# Altium project EEM_FMC_Carrier.PrjPCB (part 9 of 9)
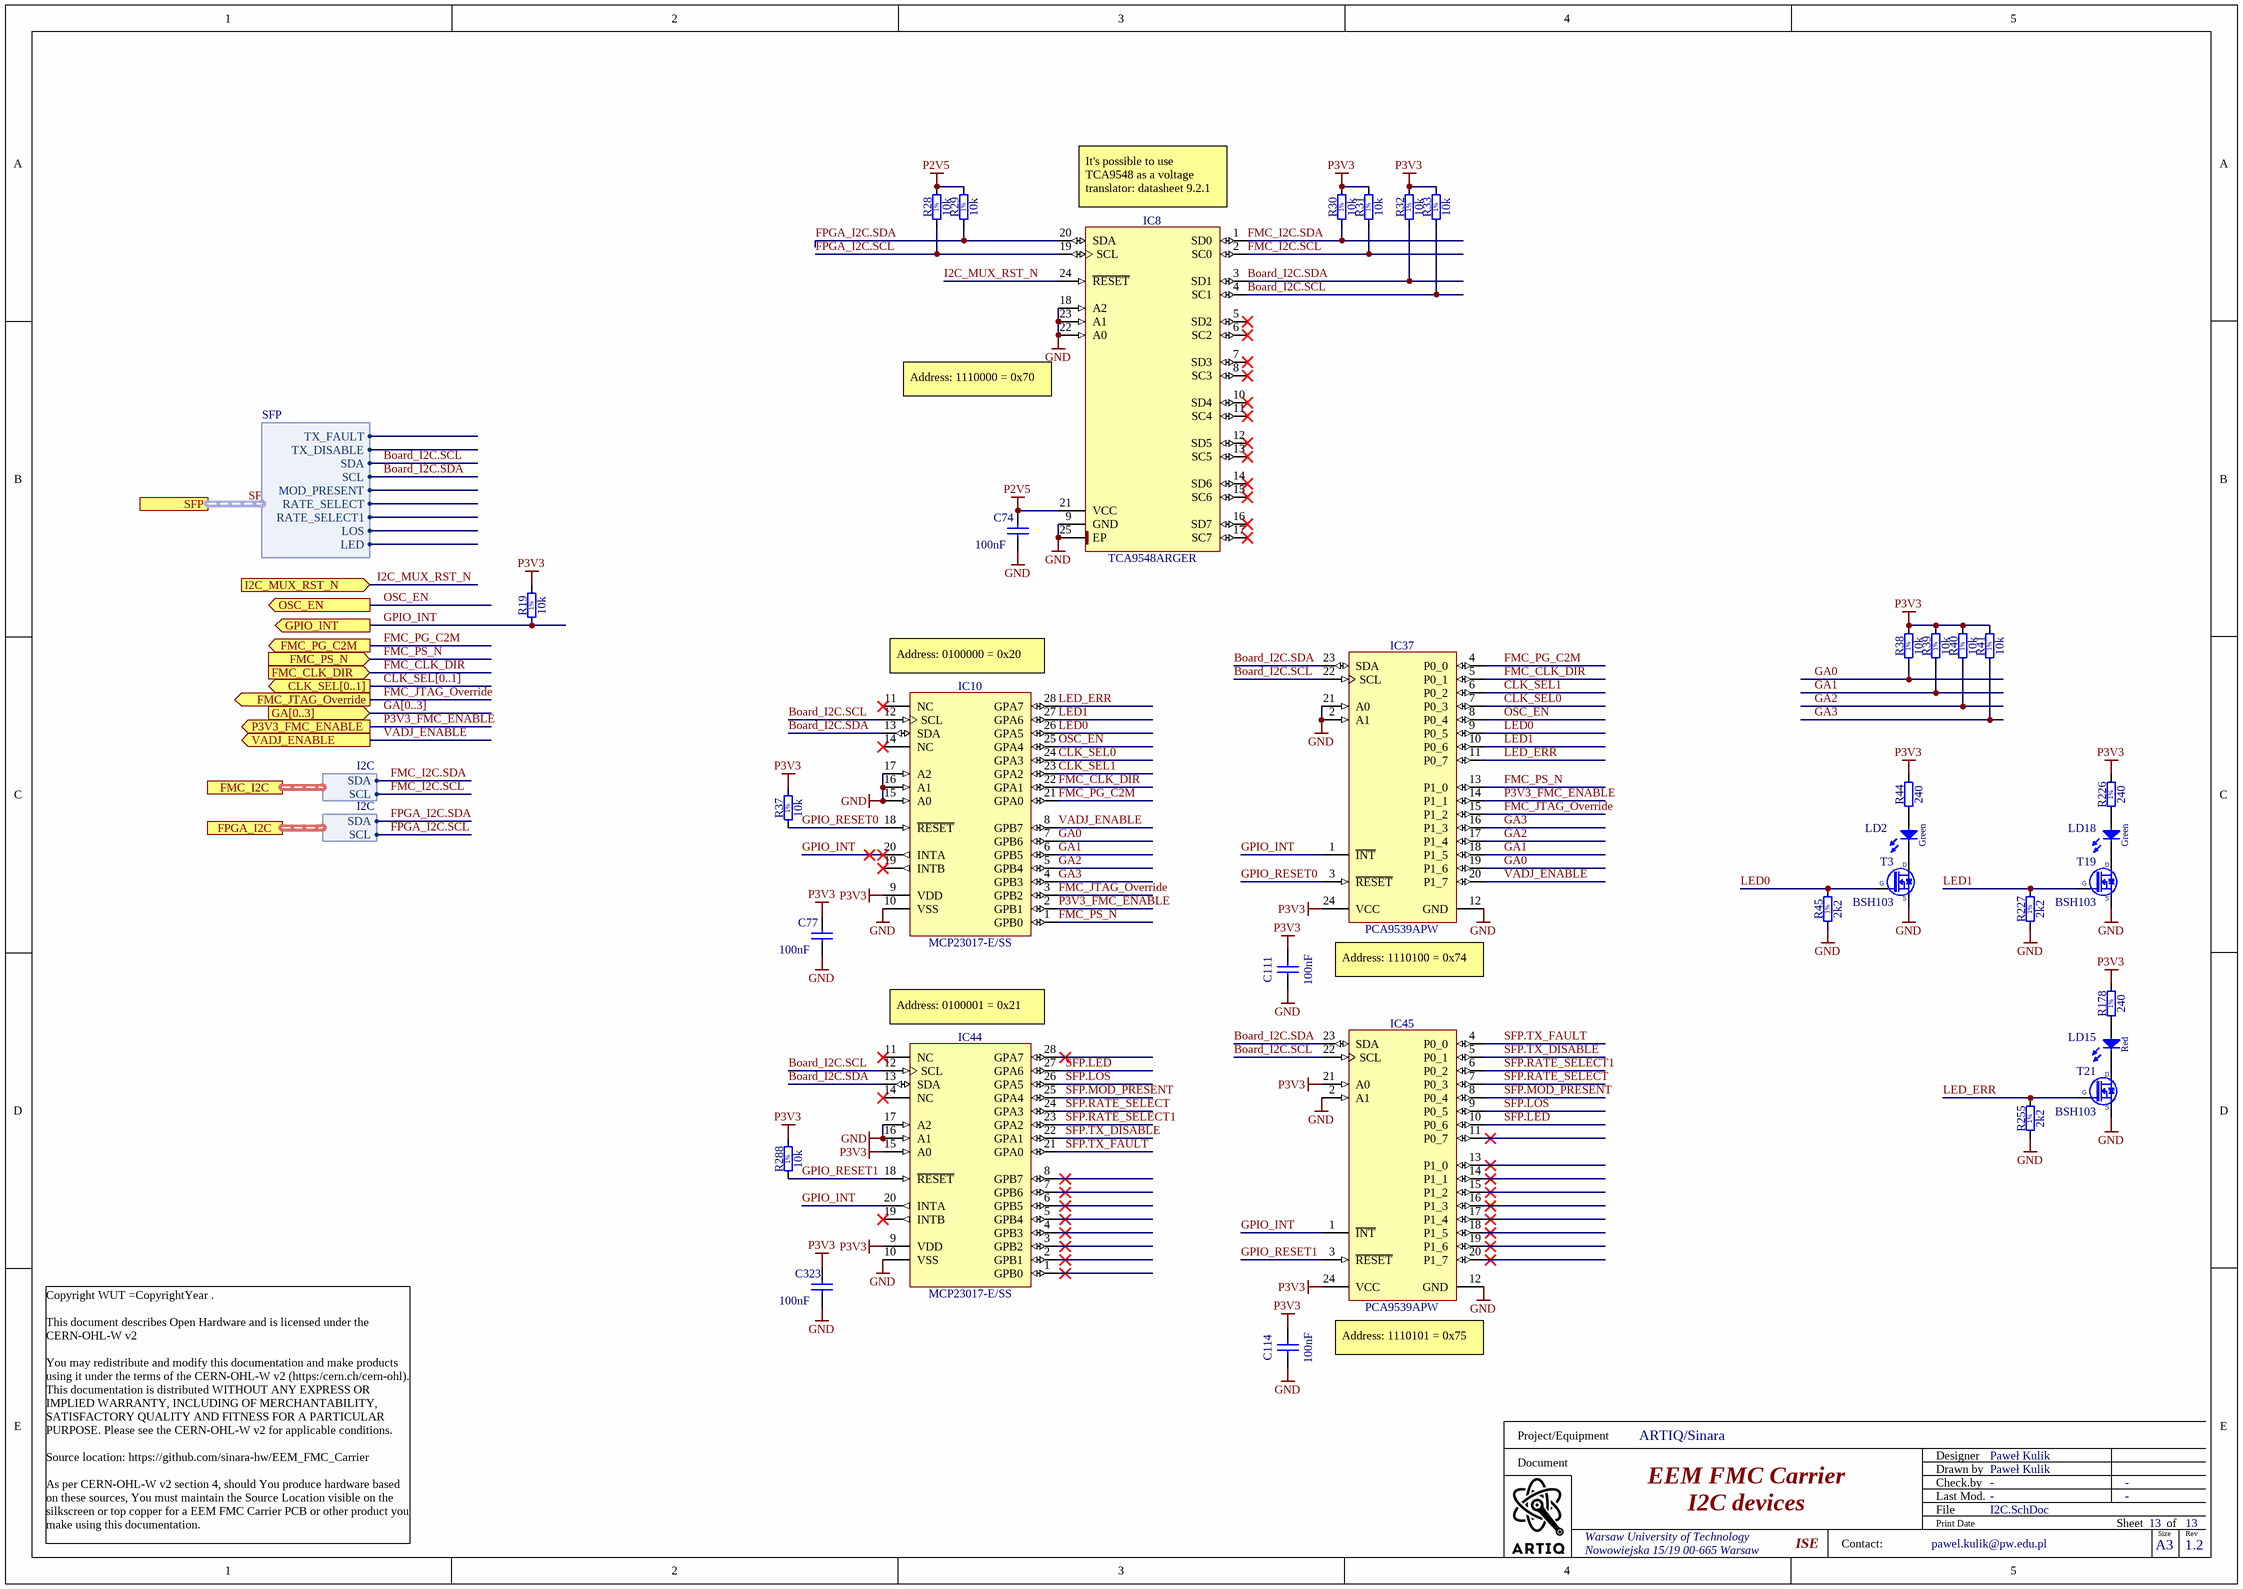
[diagram p15: I2C.SchDoc]

## Nets that join several sheets
FMC_VREFA_M2C: FPGA_FMC (C41.2 C45.2 IC4.C20 IC4.D15), FMC_Connector (J5.h1)
FMC_VREFB_M2C: FPGA_FMC (C64#1.2 C65#1.2 IC4.V3 IC4.W7), FMC_Connector (J5.k1)
GND: EEM_FMC_Carrier (C212.2 R119.2 R126.2), FPGA_EEM_Misc (28 pins), Power_Supplies (111 pins), CLK_Distribution (38 pins), FPGA_FMC (20 pins), FPGA_Bank_0_Supplies (182 pins), FPGA_GTP (60 pins), FPGA_SDRAM (60 pins), JTAG_Flash_Update (51 pins), FMC_Connector (186 pins), CPCIS_Connectors_P1_P6 (62 pins), EEM_Connectors_JTAG (65 pins), I2C (28 pins)
MGTAVCC: Power_Supplies (C242.2 L18.2), FPGA_Bank_0_Supplies (8 pins)
MGTAVTT: Power_Supplies (L23.2), FPGA_Bank_0_Supplies (9 pins), FPGA_GTP (R26.1)
P1V0: Power_Supplies (7 pins), FPGA_Bank_0_Supplies (41 pins)
P1V5: Power_Supplies (L22.2 T12.1 TP6.1), FPGA_Bank_0_Supplies (13 pins), FPGA_SDRAM (33 pins)
P1V8: Power_Supplies (5 pins), FPGA_Bank_0_Supplies (C173.2 L3.1 L5.1)
P2V5: FPGA_EEM_Misc (8 pins), Power_Supplies (8 pins), FPGA_Bank_0_Supplies (22 pins), JTAG_Flash_Update (19 pins), I2C (C74.2 IC8.21 R28.2 R29.2)
P3V3: FPGA_EEM_Misc (7 pins), Power_Supplies (7 pins), CLK_Distribution (11 pins), FPGA_FMC (6 pins), FPGA_Bank_0_Supplies (R76.2), FPGA_GTP (19 pins), FPGA_SDRAM (C88.2 IC12.7 IC12.10 R70.2), JTAG_Flash_Update (18 pins), FMC_Connector (5 pins), EEM_Connectors_JTAG (19 pins), I2C (24 pins)
P3V3_FMC: Power_Supplies (5 pins), FMC_Connector (7 pins)
P3V3_MP: Power_Supplies (5 pins), JTAG_Flash_Update (R101.2), EEM_Connectors_JTAG (5 pins)
P3V3_MP_B: Power_Supplies (C43.1 D11.2 IC14.5), CPCIS_Connectors_P1_P6 (8 pins)
P12V0: FPGA_EEM_Misc (C72.2 R27.2 T1.2), Power_Supplies (16 pins), FPGA_SDRAM (L29.1), FMC_Connector (C204.1 C205.1 J5.c35 J5.c37), CPCIS_Connectors_P1_P6 (7 pins), EEM_Connectors_JTAG (J8.28 J8.29 J9.28 J9.29)
VADJ_FMC: Power_Supplies (9 pins), FPGA_FMC (7 pins), FPGA_Bank_0_Supplies (48 pins), FMC_Connector (21 pins)
VCCBRAM: Power_Supplies (C243.2 L16.2), FPGA_Bank_0_Supplies (7 pins)
Board_I2C.SCL: FPGA_GTP (J3.4), I2C (6 pins)
Board_I2C.SDA: FPGA_GTP (J3.5), I2C (6 pins)
BP_I2C.SCL: CPCIS_Connectors_P1_P6 (D5.3 J6.B2), EEM_Connectors_JTAG (R77.1)
BP_I2C.SDA: CPCIS_Connectors_P1_P6 (D5.1 J6.C2), EEM_Connectors_JTAG (R3.1)
BP_IO.LVDS_N0: CPCIS_Connectors_P1_P6 (J6.E3), EEM_Connectors_JTAG (R161.1)
BP_IO.LVDS_N1: CPCIS_Connectors_P1_P6 (J6.B3), EEM_Connectors_JTAG (R162.1)
BP_IO.LVDS_N2: CPCIS_Connectors_P1_P6 (J6.C4), EEM_Connectors_JTAG (R163.1)
BP_IO.LVDS_N3: CPCIS_Connectors_P1_P6 (J6.L4), EEM_Connectors_JTAG (R164.1)
BP_IO.LVDS_N4: CPCIS_Connectors_P1_P6 (J6.I4), EEM_Connectors_JTAG (R167.1)
BP_IO.LVDS_N5: CPCIS_Connectors_P1_P6 (J6.K5), EEM_Connectors_JTAG (R168.1)
BP_IO.LVDS_N6: CPCIS_Connectors_P1_P6 (J6.H5), EEM_Connectors_JTAG (R169.1)
BP_IO.LVDS_N7: CPCIS_Connectors_P1_P6 (J6.F6), EEM_Connectors_JTAG (R170.1)
BP_IO.LVDS_N8: CPCIS_Connectors_P1_P6 (J6.C6), EEM_Connectors_JTAG (R171.1)
BP_IO.LVDS_N9: CPCIS_Connectors_P1_P6 (J6.L6), EEM_Connectors_JTAG (R172.1)
BP_IO.LVDS_N10: CPCIS_Connectors_P1_P6 (J6.I6), EEM_Connectors_JTAG (R173.1)
BP_IO.LVDS_N11: CPCIS_Connectors_P1_P6 (J7.E1), EEM_Connectors_JTAG (R174.1)
BP_IO.LVDS_N12: CPCIS_Connectors_P1_P6 (J7.B1), EEM_Connectors_JTAG (R175.1)
BP_IO.LVDS_N13: CPCIS_Connectors_P1_P6 (J7.K1), EEM_Connectors_JTAG (R176.1)
BP_IO.LVDS_N14: CPCIS_Connectors_P1_P6 (J7.H1), EEM_Connectors_JTAG (R177.1)
BP_IO.LVDS_N15: CPCIS_Connectors_P1_P6 (J6.F2), EEM_Connectors_JTAG (R144.2)
BP_IO.LVDS_P0: CPCIS_Connectors_P1_P6 (J6.D3), EEM_Connectors_JTAG (R145.1)
BP_IO.LVDS_P1: CPCIS_Connectors_P1_P6 (J6.A3), EEM_Connectors_JTAG (R146.1)
BP_IO.LVDS_P2: CPCIS_Connectors_P1_P6 (J6.B4), EEM_Connectors_JTAG (R147.1)
BP_IO.LVDS_P3: CPCIS_Connectors_P1_P6 (J6.K4), EEM_Connectors_JTAG (R148.1)
BP_IO.LVDS_P4: CPCIS_Connectors_P1_P6 (J6.H4), EEM_Connectors_JTAG (R149.1)
BP_IO.LVDS_P5: CPCIS_Connectors_P1_P6 (J6.J5), EEM_Connectors_JTAG (R150.1)
BP_IO.LVDS_P6: CPCIS_Connectors_P1_P6 (J6.G5), EEM_Connectors_JTAG (R151.1)
BP_IO.LVDS_P7: CPCIS_Connectors_P1_P6 (J6.E6), EEM_Connectors_JTAG (R152.1)
BP_IO.LVDS_P8: CPCIS_Connectors_P1_P6 (J6.B6), EEM_Connectors_JTAG (R153.1)
BP_IO.LVDS_P9: CPCIS_Connectors_P1_P6 (J6.K6), EEM_Connectors_JTAG (R154.1)
BP_IO.LVDS_P10: CPCIS_Connectors_P1_P6 (J6.H6), EEM_Connectors_JTAG (R155.1)
BP_IO.LVDS_P11: CPCIS_Connectors_P1_P6 (J7.D1), EEM_Connectors_JTAG (R156.1)
BP_IO.LVDS_P12: CPCIS_Connectors_P1_P6 (J7.A1), EEM_Connectors_JTAG (R157.1)
BP_IO.LVDS_P13: CPCIS_Connectors_P1_P6 (J7.J1), EEM_Connectors_JTAG (R158.1)
BP_IO.LVDS_P14: CPCIS_Connectors_P1_P6 (J7.G1), EEM_Connectors_JTAG (R159.1)
BP_IO.LVDS_P15: CPCIS_Connectors_P1_P6 (J6.E2), EEM_Connectors_JTAG (R143.2)
BP_JTAG.TCK: JTAG_Flash_Update (IC16.3), EEM_Connectors_JTAG (IC30.10)
BP_JTAG.TDI: JTAG_Flash_Update (IC16.13), EEM_Connectors_JTAG (IC30.15)
BP_JTAG.TDO: JTAG_Flash_Update (IC16.10), EEM_Connectors_JTAG (IC31.2)
BP_JTAG.TMS: JTAG_Flash_Update (IC16.6), EEM_Connectors_JTAG (IC30.11)
BP_JTAG.TRSTn: JTAG_Flash_Update (IC19.1), EEM_Connectors_JTAG (IC30.14)
BP_MGT.Rx_N: FPGA_GTP (IC36.14), CPCIS_Connectors_P1_P6 (R142.1)
BP_MGT.Rx_P: FPGA_GTP (IC36.15), CPCIS_Connectors_P1_P6 (R141.1)
BP_MGT.Tx_N: FPGA_GTP (IC36.12), CPCIS_Connectors_P1_P6 (R246.1)
BP_MGT.Tx_P: FPGA_GTP (IC36.13), CPCIS_Connectors_P1_P6 (R245.1)
CFG_CCLK: FPGA_Bank_0_Supplies (IC4.L12), JTAG_Flash_Update (IC20.9 IC22.16)
CFG_D02: FPGA_EEM_Misc (IC4.P21), JTAG_Flash_Update (IC22.9 R98.1)
CFG_D03: FPGA_EEM_Misc (IC4.R21), JTAG_Flash_Update (IC22.1 R99.1)
CFG_DIN_D1: FPGA_EEM_Misc (IC4.R22), JTAG_Flash_Update (IC20.3 IC22.8)
CFG_FCS: FPGA_EEM_Misc (IC4.T19), JTAG_Flash_Update (IC20.10 IC22.7 R100.1)
CFG_MOSI_D0: FPGA_EEM_Misc (IC4.P22), JTAG_Flash_Update (IC20.2 IC22.15)
CLK_SEL0: CLK_Distribution (IC2.15 SW1.1 T18.1), I2C (IC10.24 IC37.7)
CLK_SEL1: CLK_Distribution (IC2.18 SW1.2), I2C (IC10.23 IC37.6)
EEM0_I2C.SCL: Power_Supplies (IC33.2), JTAG_Flash_Update (IC23.6), EEM_Connectors_JTAG (5 pins)
EEM0_I2C.SDA: Power_Supplies (IC33.1), JTAG_Flash_Update (IC23.5), EEM_Connectors_JTAG (5 pins)
EEM_IO.LVDS_N0: FPGA_EEM_Misc (IC4.V19), EEM_Connectors_JTAG (IC27.18)
EEM_IO.LVDS_N1: FPGA_EEM_Misc (IC4.R17), EEM_Connectors_JTAG (IC27.16)
EEM_IO.LVDS_N2: FPGA_EEM_Misc (IC4.T18), EEM_Connectors_JTAG (IC28.18)
EEM_IO.LVDS_N3: FPGA_EEM_Misc (IC4.W17), EEM_Connectors_JTAG (IC28.16)
EEM_IO.LVDS_N4: FPGA_EEM_Misc (IC4.R19), EEM_Connectors_JTAG (IC29.18)
EEM_IO.LVDS_N5: FPGA_EEM_Misc (IC4.R16), EEM_Connectors_JTAG (J8.18 R168.2)
EEM_IO.LVDS_N6: FPGA_EEM_Misc (IC4.U18), EEM_Connectors_JTAG (J8.21 R169.2)
EEM_IO.LVDS_N7: FPGA_EEM_Misc (IC4.AA21), EEM_Connectors_JTAG (J8.24 R170.2)
EEM_IO.LVDS_N8: FPGA_EEM_Misc (IC4.V20), EEM_Connectors_JTAG (J9.3 R171.2)
EEM_IO.LVDS_N9: FPGA_EEM_Misc (IC4.P17), EEM_Connectors_JTAG (J9.6 R172.2)
EEM_IO.LVDS_N10: FPGA_EEM_Misc (IC4.N14), EEM_Connectors_JTAG (J9.9 R173.2)
EEM_IO.LVDS_N11: FPGA_EEM_Misc (IC4.Y22), EEM_Connectors_JTAG (J9.12 R174.2)
EEM_IO.LVDS_N12: FPGA_EEM_Misc (IC4.W22), EEM_Connectors_JTAG (J9.15 R175.2)
EEM_IO.LVDS_N13: FPGA_EEM_Misc (IC4.AB22), EEM_Connectors_JTAG (J9.18 R176.2)
EEM_IO.LVDS_N14: FPGA_EEM_Misc (IC4.AB20), EEM_Connectors_JTAG (J9.21 R177.2)
EEM_IO.LVDS_N15: FPGA_EEM_Misc (IC4.AB18), EEM_Connectors_JTAG (J9.24 R144.1)
EEM_IO.LVDS_P0: FPGA_EEM_Misc (IC4.V18), EEM_Connectors_JTAG (IC27.19)
EEM_IO.LVDS_P1: FPGA_EEM_Misc (IC4.P16), EEM_Connectors_JTAG (IC27.17)
EEM_IO.LVDS_P2: FPGA_EEM_Misc (IC4.R18), EEM_Connectors_JTAG (IC28.19)
EEM_IO.LVDS_P3: FPGA_EEM_Misc (IC4.V17), EEM_Connectors_JTAG (IC28.17)
EEM_IO.LVDS_P4: FPGA_EEM_Misc (IC4.P19), EEM_Connectors_JTAG (IC29.19)
EEM_IO.LVDS_P5: FPGA_EEM_Misc (IC4.P15), EEM_Connectors_JTAG (J8.17 R150.2)
EEM_IO.LVDS_P6: FPGA_EEM_Misc (IC4.U17), EEM_Connectors_JTAG (J8.20 R151.2)
EEM_IO.LVDS_P7: FPGA_EEM_Misc (IC4.AA20), EEM_Connectors_JTAG (J8.23 R152.2)
EEM_IO.LVDS_P8: FPGA_EEM_Misc (IC4.U20), EEM_Connectors_JTAG (J9.2 R153.2)
EEM_IO.LVDS_P9: FPGA_EEM_Misc (IC4.N17), EEM_Connectors_JTAG (J9.5 R154.2)
EEM_IO.LVDS_P10: FPGA_EEM_Misc (IC4.N13), EEM_Connectors_JTAG (J9.8 R155.2)
EEM_IO.LVDS_P11: FPGA_EEM_Misc (IC4.Y21), EEM_Connectors_JTAG (J9.11 R156.2)
EEM_IO.LVDS_P12: FPGA_EEM_Misc (IC4.W21), EEM_Connectors_JTAG (J9.14 R157.2)
EEM_IO.LVDS_P13: FPGA_EEM_Misc (IC4.AB21), EEM_Connectors_JTAG (J9.17 R158.2)
EEM_IO.LVDS_P14: FPGA_EEM_Misc (IC4.AA19), EEM_Connectors_JTAG (J9.20 R159.2)
EEM_IO.LVDS_P15: FPGA_EEM_Misc (IC4.AA18), EEM_Connectors_JTAG (J9.23 R143.1)
FMC.HA_N0: FPGA_FMC (IC4.J4), FMC_Connector (J5.f5)
FMC.HA_N1: FPGA_FMC (IC4.G3), FMC_Connector (J5.e3)
FMC.HA_N2: FPGA_FMC (IC4.L1), FMC_Connector (J5.k8)
FMC.HA_N3: FPGA_FMC (IC4.J1), FMC_Connector (J5.j7)
FMC.HA_N4: FPGA_FMC (IC4.L4), FMC_Connector (J5.f8)
FMC.HA_N5: FPGA_FMC (IC4.J6), FMC_Connector (J5.e7)
FMC.HA_N6: FPGA_FMC (IC4.D2), FMC_Connector (J5.k11)
FMC.HA_N7: FPGA_FMC (IC4.M2), FMC_Connector (J5.j10)
FMC.HA_N8: FPGA_FMC (IC4.B2), FMC_Connector (J5.f11)
FMC.HA_N9: FPGA_FMC (IC4.M5), FMC_Connector (J5.e10)
FMC.HA_N10: FPGA_FMC (IC4.F1), FMC_Connector (J5.k14)
FMC.HA_N11: FPGA_FMC (IC4.D1), FMC_Connector (J5.j13)
FMC.HA_N12: FPGA_FMC (IC4.E3), FMC_Connector (J5.f14)
FMC.HA_N13: FPGA_FMC (IC4.A1), FMC_Connector (J5.e13)
FMC.HA_N14: FPGA_FMC (IC4.N2), FMC_Connector (J5.j16)
FMC.HA_N15: FPGA_FMC (IC4.J2), FMC_Connector (J5.f17)
FMC.HA_N16: FPGA_FMC (IC4.G2), FMC_Connector (J5.e16)
FMC.HA_N17: FPGA_FMC (IC4.G4), FMC_Connector (J5.k17)
FMC.HA_N18: FPGA_FMC (IC4.K3), FMC_Connector (J5.j19)
FMC.HA_N19: FPGA_FMC (IC4.P1), FMC_Connector (J5.f20)
FMC.HA_N20: FPGA_FMC (IC4.H5), FMC_Connector (J5.e19)
FMC.HA_N21: FPGA_FMC (IC4.N3), FMC_Connector (J5.k20)
FMC.HA_N22: FPGA_FMC (IC4.N5), FMC_Connector (J5.j22)
FMC.HA_N23: FPGA_FMC (IC4.P4), FMC_Connector (J5.k23)
FMC.HA_P0: FPGA_FMC (IC4.K4), FMC_Connector (J5.f4)
FMC.HA_P1: FPGA_FMC (IC4.H3), FMC_Connector (J5.e2)
FMC.HA_P2: FPGA_FMC (IC4.M1), FMC_Connector (J5.k7)
FMC.HA_P3: FPGA_FMC (IC4.K1), FMC_Connector (J5.j6)
FMC.HA_P4: FPGA_FMC (IC4.L5), FMC_Connector (J5.f7)
FMC.HA_P5: FPGA_FMC (IC4.K6), FMC_Connector (J5.e6)
FMC.HA_P6: FPGA_FMC (IC4.E2), FMC_Connector (J5.k10)
FMC.HA_P7: FPGA_FMC (IC4.M3), FMC_Connector (J5.j9)
FMC.HA_P8: FPGA_FMC (IC4.C2), FMC_Connector (J5.f10)
FMC.HA_P9: FPGA_FMC (IC4.M6), FMC_Connector (J5.e9)
FMC.HA_P10: FPGA_FMC (IC4.G1), FMC_Connector (J5.k13)
FMC.HA_P11: FPGA_FMC (IC4.E1), FMC_Connector (J5.j12)
FMC.HA_P12: FPGA_FMC (IC4.F3), FMC_Connector (J5.f13)
FMC.HA_P13: FPGA_FMC (IC4.B1), FMC_Connector (J5.e12)
FMC.HA_P14: FPGA_FMC (IC4.P2), FMC_Connector (J5.j15)
FMC.HA_P15: FPGA_FMC (IC4.K2), FMC_Connector (J5.f16)
FMC.HA_P16: FPGA_FMC (IC4.H2), FMC_Connector (J5.e15)
FMC.HA_P17: FPGA_FMC (IC4.H4), FMC_Connector (J5.k16)
FMC.HA_P18: FPGA_FMC (IC4.L3), FMC_Connector (J5.j18)
FMC.HA_P19: FPGA_FMC (IC4.R1), FMC_Connector (J5.f19)
FMC.HA_P20: FPGA_FMC (IC4.J5), FMC_Connector (J5.e18)
FMC.HA_P21: FPGA_FMC (IC4.N4), FMC_Connector (J5.k19)
FMC.HA_P22: FPGA_FMC (IC4.P6), FMC_Connector (J5.j21)
FMC.HA_P23: FPGA_FMC (IC4.P5), FMC_Connector (J5.k22)
FMC.HB_N0: FPGA_FMC (IC4.U5), FMC_Connector (J5.k26)
FMC.HB_N1: FPGA_FMC (IC4.T4), FMC_Connector (J5.j25)
FMC.HB_N2: FPGA_FMC (IC4.T6), FMC_Connector (J5.f23)
FMC.HB_N3: FPGA_FMC (IC4.R2), FMC_Connector (J5.e22)
FMC.HB_N4: FPGA_FMC (IC4.U1), FMC_Connector (J5.f26)
FMC.HB_N5: FPGA_FMC (IC4.V5), FMC_Connector (J5.e25)
FMC.HB_N6: FPGA_FMC (IC4.W4), FMC_Connector (J5.k29)
FMC.HB_N7: FPGA_FMC (IC4.W5), FMC_Connector (J5.j28)
FMC.HB_N8: FPGA_FMC (IC4.V8), FMC_Connector (J5.f29)
FMC.HB_N9: FPGA_FMC (IC4.Y7), FMC_Connector (J5.e28)
FMC.HB_N10: FPGA_FMC (IC4.AB2), FMC_Connector (J5.k32)
FMC.HB_N11: FPGA_FMC (IC4.Y2), FMC_Connector (J5.j31)
FMC.HB_N12: FPGA_FMC (IC4.AA3), FMC_Connector (J5.f32)
FMC.HB_N13: FPGA_FMC (IC4.Y1), FMC_Connector (J5.e31)
FMC.HB_N14: FPGA_FMC (IC4.V2), FMC_Connector (J5.k35)
FMC.HB_N15: FPGA_FMC (IC4.AB5), FMC_Connector (J5.j34)
FMC.HB_N16: FPGA_FMC (IC4.Y9), FMC_Connector (J5.f35)
FMC.HB_N17: FPGA_FMC (IC4.AA4), FMC_Connector (J5.k38)
FMC.HB_N18: FPGA_FMC (IC4.AB6), FMC_Connector (J5.j37)
FMC.HB_N19: FPGA_FMC (IC4.AB1), FMC_Connector (J5.e34)
FMC.HB_N20: FPGA_FMC (IC4.AA6), FMC_Connector (J5.f38)
FMC.HB_N21: FPGA_FMC (IC4.AB8), FMC_Connector (J5.e37)
FMC.HB_P0: FPGA_FMC (IC4.T5), FMC_Connector (J5.k25)
FMC.HB_P1: FPGA_FMC (IC4.R4), FMC_Connector (J5.j24)
FMC.HB_P2: FPGA_FMC (IC4.R6), FMC_Connector (J5.f22)
FMC.HB_P3: FPGA_FMC (IC4.R3), FMC_Connector (J5.e21)
FMC.HB_P4: FPGA_FMC (IC4.T1), FMC_Connector (J5.f25)
FMC.HB_P5: FPGA_FMC (IC4.U6), FMC_Connector (J5.e24)
FMC.HB_P6: FPGA_FMC (IC4.V4), FMC_Connector (J5.k28)
FMC.HB_P7: FPGA_FMC (IC4.W6), FMC_Connector (J5.j27)
FMC.HB_P8: FPGA_FMC (IC4.V9), FMC_Connector (J5.f28)
FMC.HB_P9: FPGA_FMC (IC4.Y8), FMC_Connector (J5.e27)
FMC.HB_P10: FPGA_FMC (IC4.AB3), FMC_Connector (J5.k31)
FMC.HB_P11: FPGA_FMC (IC4.W2), FMC_Connector (J5.j30)
FMC.HB_P12: FPGA_FMC (IC4.Y3), FMC_Connector (J5.f31)
FMC.HB_P13: FPGA_FMC (IC4.W1), FMC_Connector (J5.e30)
FMC.HB_P14: FPGA_FMC (IC4.U2), FMC_Connector (J5.k34)
FMC.HB_P15: FPGA_FMC (IC4.AA5), FMC_Connector (J5.j33)
FMC.HB_P16: FPGA_FMC (IC4.W9), FMC_Connector (J5.f34)
FMC.HB_P17: FPGA_FMC (IC4.Y4), FMC_Connector (J5.k37)
FMC.HB_P18: FPGA_FMC (IC4.AB7), FMC_Connector (J5.j36)
FMC.HB_P19: FPGA_FMC (IC4.AA1), FMC_Connector (J5.e33)
FMC.HB_P20: FPGA_FMC (IC4.Y6), FMC_Connector (J5.f37)
FMC.HB_P21: FPGA_FMC (IC4.AA8), FMC_Connector (J5.e36)
FMC.LA_N0: FPGA_FMC (IC4.B18), FMC_Connector (J5.g7)
FMC.LA_N1: FPGA_FMC (IC4.D19), FMC_Connector (J5.d9)
FMC.LA_N2: FPGA_FMC (IC4.E17), FMC_Connector (J5.h8)
FMC.LA_N3: FPGA_FMC (IC4.E18), FMC_Connector (J5.g10)
FMC.LA_N4: FPGA_FMC (IC4.B22), FMC_Connector (J5.h11)
FMC.LA_N5: FPGA_FMC (IC4.A16), FMC_Connector (J5.d12)
FMC.LA_N6: FPGA_FMC (IC4.B16), FMC_Connector (J5.c11)
FMC.LA_N7: FPGA_FMC (IC4.A19), FMC_Connector (J5.h14)
FMC.LA_N8: FPGA_FMC (IC4.A21), FMC_Connector (J5.g13)
FMC.LA_N9: FPGA_FMC (IC4.F20), FMC_Connector (J5.d15)
FMC.LA_N10: FPGA_FMC (IC4.C15), FMC_Connector (J5.c15)
FMC.LA_N11: FPGA_FMC (IC4.A20), FMC_Connector (J5.h17)
FMC.LA_N12: FPGA_FMC (IC4.D16), FMC_Connector (J5.g16)
FMC.LA_N13: FPGA_FMC (IC4.A14), FMC_Connector (J5.d18)
FMC.LA_N14: FPGA_FMC (IC4.B13), FMC_Connector (J5.c19)
FMC.LA_N15: FPGA_FMC (IC4.E14), FMC_Connector (J5.h20)
FMC.LA_N16: FPGA_FMC (IC4.F14), FMC_Connector (J5.g19)
FMC.LA_N17: FPGA_FMC (IC4.V14), FMC_Connector (J5.d21)
FMC.LA_N18: FPGA_FMC (IC4.W12), FMC_Connector (J5.c23)
FMC.LA_N19: FPGA_FMC (IC4.AB10), FMC_Connector (J5.h23)
FMC.LA_N20: FPGA_FMC (IC4.V15), FMC_Connector (J5.g22)
FMC.LA_N21: FPGA_FMC (IC4.W10), FMC_Connector (J5.h26)
FMC.LA_N22: FPGA_FMC (IC4.AB12), FMC_Connector (J5.g25)
FMC.LA_N23: FPGA_FMC (IC4.AA11), FMC_Connector (J5.d24)
FMC.LA_N24: FPGA_FMC (IC4.W16), FMC_Connector (J5.h29)
FMC.LA_N25: FPGA_FMC (IC4.Y12), FMC_Connector (J5.g28)
FMC.LA_N26: FPGA_FMC (IC4.AA14), FMC_Connector (J5.d27)
FMC.LA_N27: FPGA_FMC (IC4.AB13), FMC_Connector (J5.c27)
FMC.LA_N28: FPGA_FMC (IC4.AB15), FMC_Connector (J5.h32)
FMC.LA_N29: FPGA_FMC (IC4.AA16), FMC_Connector (J5.g31)
FMC.LA_N30: FPGA_FMC (IC4.U16), FMC_Connector (J5.h35)
FMC.LA_N31: FPGA_FMC (IC4.Y14), FMC_Connector (J5.g34)
FMC.LA_N32: FPGA_FMC (IC4.AB17), FMC_Connector (J5.h38)
FMC.LA_N33: FPGA_FMC (IC4.T15), FMC_Connector (J5.g37)
FMC.LA_P0: FPGA_FMC (IC4.B17), FMC_Connector (J5.g6)
FMC.LA_P1: FPGA_FMC (IC4.E19), FMC_Connector (J5.d8)
FMC.LA_P2: FPGA_FMC (IC4.F16), FMC_Connector (J5.h7)
FMC.LA_P3: FPGA_FMC (IC4.F18), FMC_Connector (J5.g9)
FMC.LA_P4: FPGA_FMC (IC4.C22), FMC_Connector (J5.h10)
FMC.LA_P5: FPGA_FMC (IC4.A15), FMC_Connector (J5.d11)
FMC.LA_P6: FPGA_FMC (IC4.B15), FMC_Connector (J5.c10)
FMC.LA_P7: FPGA_FMC (IC4.A18), FMC_Connector (J5.h13)
FMC.LA_P8: FPGA_FMC (IC4.B21), FMC_Connector (J5.g12)
FMC.LA_P9: FPGA_FMC (IC4.F19), FMC_Connector (J5.d14)
FMC.LA_P10: FPGA_FMC (IC4.C14), FMC_Connector (J5.c14)
FMC.LA_P11: FPGA_FMC (IC4.B20), FMC_Connector (J5.h16)
FMC.LA_P12: FPGA_FMC (IC4.E16), FMC_Connector (J5.g15)
FMC.LA_P13: FPGA_FMC (IC4.A13), FMC_Connector (J5.d17)
FMC.LA_P14: FPGA_FMC (IC4.C13), FMC_Connector (J5.c18)
FMC.LA_P15: FPGA_FMC (IC4.E13), FMC_Connector (J5.h19)
FMC.LA_P16: FPGA_FMC (IC4.F13), FMC_Connector (J5.g18)
FMC.LA_P17: FPGA_FMC (IC4.V13), FMC_Connector (J5.d20)
FMC.LA_P18: FPGA_FMC (IC4.W11), FMC_Connector (J5.c22)
FMC.LA_P19: FPGA_FMC (IC4.AA9), FMC_Connector (J5.h22)
FMC.LA_P20: FPGA_FMC (IC4.U15), FMC_Connector (J5.g21)
FMC.LA_P21: FPGA_FMC (IC4.V10), FMC_Connector (J5.h25)
FMC.LA_P22: FPGA_FMC (IC4.AB11), FMC_Connector (J5.g24)
FMC.LA_P23: FPGA_FMC (IC4.AA10), FMC_Connector (J5.d23)
FMC.LA_P24: FPGA_FMC (IC4.W15), FMC_Connector (J5.h28)
FMC.LA_P25: FPGA_FMC (IC4.Y11), FMC_Connector (J5.g27)
FMC.LA_P26: FPGA_FMC (IC4.Y13), FMC_Connector (J5.d26)
FMC.LA_P27: FPGA_FMC (IC4.AA13), FMC_Connector (J5.c26)
FMC.LA_P28: FPGA_FMC (IC4.AA15), FMC_Connector (J5.h31)
FMC.LA_P29: FPGA_FMC (IC4.Y16), FMC_Connector (J5.g30)
FMC.LA_P30: FPGA_FMC (IC4.T16), FMC_Connector (J5.h34)
FMC.LA_P31: FPGA_FMC (IC4.W14), FMC_Connector (J5.g33)
FMC.LA_P32: FPGA_FMC (IC4.AB16), FMC_Connector (J5.h37)
FMC.LA_P33: FPGA_FMC (IC4.T14), FMC_Connector (J5.g36)
FMC_CLK.CLK_BIDIR_N2: FPGA_EEM_Misc (IC4.Y19), FMC_Connector (C211.2)
FMC_CLK.CLK_BIDIR_N3: FPGA_EEM_Misc (IC4.W20), FMC_Connector (C216.2)
FMC_CLK.CLK_BIDIR_P2: FPGA_EEM_Misc (IC4.Y18), FMC_Connector (C210.2)
FMC_CLK.CLK_BIDIR_P3: FPGA_EEM_Misc (IC4.W19), FMC_Connector (C215.2)
FMC_CLK.CLK_M2C_N0: FPGA_FMC (IC4.C19 R24.2), FMC_Connector (J5.h5)
FMC_CLK.CLK_M2C_N1: FPGA_FMC (IC4.C17 R25.2), FMC_Connector (J5.g3)
FMC_CLK.CLK_M2C_P0: FPGA_FMC (IC4.C18 R24.1), FMC_Connector (J5.h4)
FMC_CLK.CLK_M2C_P1: FPGA_FMC (IC4.D17 R25.1), FMC_Connector (J5.g2)
FMC_CLK_DIR: FMC_Connector (J5.b1 R124.2 R125.2), I2C (IC10.22 IC37.5)
FMC_I2C.SCL: FMC_Connector (J5.c30), I2C (IC8.2 R31.1)
FMC_I2C.SDA: FMC_Connector (J5.c31), I2C (IC8.1 R30.1)
FMC_JTAG.TCK: JTAG_Flash_Update (R90.2), FMC_Connector (J5.d29)
FMC_JTAG.TDI: JTAG_Flash_Update (IC18.1 R96.2), FMC_Connector (J5.d30)
FMC_JTAG.TDO: JTAG_Flash_Update (IC18.3), FMC_Connector (J5.d31)
FMC_JTAG.TMS: JTAG_Flash_Update (R88.2), FMC_Connector (J5.d33)
FMC_JTAG.TRSTn: JTAG_Flash_Update (IC19.4), FMC_Connector (J5.d34)
FMC_JTAG_Override: JTAG_Flash_Update (D4.2), I2C (IC10.3 IC37.15)
FMC_MGT.DP_C2M_N0: FPGA_GTP (C55.2), FMC_Connector (J5.c3)
FMC_MGT.DP_C2M_N1: FPGA_GTP (C59.2), FMC_Connector (J5.a23)
FMC_MGT.DP_C2M_N2: FPGA_GTP (IC41.18), FMC_Connector (J5.a27)
FMC_MGT.DP_C2M_N3: FPGA_GTP (IC36.16), FMC_Connector (J5.a31)
FMC_MGT.DP_C2M_P0: FPGA_GTP (C53.2), FMC_Connector (J5.c2)
FMC_MGT.DP_C2M_P1: FPGA_GTP (C57.2), FMC_Connector (J5.a22)
FMC_MGT.DP_C2M_P2: FPGA_GTP (IC41.19), FMC_Connector (J5.a26)
FMC_MGT.DP_C2M_P3: FPGA_GTP (IC36.17), FMC_Connector (J5.a30)
FMC_MGT.DP_M2C_N0: FPGA_GTP (C54.1), FMC_Connector (J5.c7)
FMC_MGT.DP_M2C_N1: FPGA_GTP (C58.1), FMC_Connector (J5.a3)
FMC_MGT.DP_M2C_N2: FPGA_GTP (IC41.16), FMC_Connector (J5.a7)
FMC_MGT.DP_M2C_N3: FPGA_GTP (IC36.18), FMC_Connector (J5.a11)
FMC_MGT.DP_M2C_P0: FPGA_GTP (C52.1), FMC_Connector (J5.c6)
FMC_MGT.DP_M2C_P1: FPGA_GTP (C56.1), FMC_Connector (J5.a2)
FMC_MGT.DP_M2C_P2: FPGA_GTP (IC41.17), FMC_Connector (J5.a6)
FMC_MGT.DP_M2C_P3: FPGA_GTP (IC36.19), FMC_Connector (J5.a10)
FMC_MGT.GBTCLK_M2C_N0: FPGA_GTP (IC4.E6), FMC_Connector (C200.2)
FMC_MGT.GBTCLK_M2C_P0: FPGA_GTP (IC4.F6), FMC_Connector (C199.2)
FMC_PG_C2M: FMC_Connector (J5.d1 R123.1), I2C (IC10.21 IC37.4)
FMC_PG_M2C: FPGA_SDRAM (R258.1), FMC_Connector (J5.f1 R122.1)
FMC_PS_N: JTAG_Flash_Update (R97.2), FMC_Connector (J5.h2 R121.1), I2C (IC10.1 IC37.13)
FMC_REF0_CLK.CLK_N: CLK_Distribution (IC1.23 R16.1), FMC_Connector (C214.2)
FMC_REF0_CLK.CLK_P: CLK_Distribution (IC1.24 R15.1), FMC_Connector (C213.2)
FMC_REF1_CLK.CLK_N: CLK_Distribution (IC1.27 R11.1), FMC_Connector (C218.2)
FMC_REF1_CLK.CLK_P: CLK_Distribution (IC1.28 R9.1), FMC_Connector (C217.2)
FPGA_DONE: FPGA_Bank_0_Supplies (IC4.G11 R78.1 T16.1), JTAG_Flash_Update (R107.1)
FPGA_I2C.SCL: FPGA_EEM_Misc (IC4.V22), JTAG_Flash_Update (IC21.3), I2C (IC8.19 R28.1)
FPGA_I2C.SDA: FPGA_EEM_Misc (IC4.T21), JTAG_Flash_Update (IC21.2), I2C (IC8.20 R29.1)
FPGA_INIT_B: FPGA_Bank_0_Supplies (IC4.U12 R81.1), JTAG_Flash_Update (T6.3)
FPGA_JTAG.TCK: FPGA_EEM_Misc (IC9.6), FPGA_Bank_0_Supplies (IC4.V12)
FPGA_JTAG.TDI: FPGA_EEM_Misc (IC9.8), FPGA_Bank_0_Supplies (IC4.R13)
FPGA_JTAG.TDO: FPGA_EEM_Misc (IC17.3), FPGA_Bank_0_Supplies (IC4.U13)
FPGA_JTAG.TMS: FPGA_EEM_Misc (IC9.7), FPGA_Bank_0_Supplies (IC4.T13)
FPGA_JTAG_3V3.TCK: FPGA_EEM_Misc (IC9.18), JTAG_Flash_Update (R91.2)
FPGA_JTAG_3V3.TDI: FPGA_EEM_Misc (IC9.16), JTAG_Flash_Update (IC16.12)
FPGA_JTAG_3V3.TDO: FPGA_EEM_Misc (IC17.21), JTAG_Flash_Update (R96.1)
FPGA_JTAG_3V3.TMS: FPGA_EEM_Misc (IC9.17), JTAG_Flash_Update (R89.2)
GA0: CPCIS_Connectors_P1_P6 (R130.1), I2C (IC10.7 IC37.19 R38.1)
GA1: CPCIS_Connectors_P1_P6 (R131.1), I2C (IC10.6 IC37.18 R39.1)
GA2: CPCIS_Connectors_P1_P6 (R136.1), I2C (IC10.5 IC37.17 R40.1)
GA3: CPCIS_Connectors_P1_P6 (R140.1), I2C (IC10.4 IC37.16 R41.1)
GPIO_INT: FPGA_EEM_Misc (IC9.20), I2C (5 pins)
GTP2_SEL: FPGA_FMC (IC4.T3), FPGA_GTP (R284.2 T22.1)
GTP3_SEL: FPGA_FMC (IC4.F4), FPGA_GTP (R253.2 T17.1)
GTP_CLK.CLK_N: CLK_Distribution (C6.2), FPGA_GTP (IC4.E10)
GTP_CLK.CLK_P: CLK_Distribution (C4.2), FPGA_GTP (IC4.F10)
I2C_MUX_RST_N: FPGA_EEM_Misc (IC4.R14), I2C (IC8.24)
NetC3_1: EEM_FMC_Carrier (J4.1), CLK_Distribution (C3.1)
NetJ4_2: EEM_FMC_Carrier (J4.2), CLK_Distribution (R13.2 R14.1 TR1.6)
OSC_EN: CLK_Distribution (OSC1.1 R256.1), I2C (IC10.25 IC37.8)
P3V3_FMC_ENABLE: Power_Supplies (IC32.37 R191.2), I2C (IC10.2 IC37.14)
PE_CLK.CLK_N: CLK_Distribution (C11.1 C13.1), CPCIS_Connectors_P1_P6 (R128.1)
PE_CLK.CLK_P: CLK_Distribution (C9.1 C12.1), CPCIS_Connectors_P1_P6 (R127.1)
PGOOD_FMC: FPGA_EEM_Misc (IC4.P20), Power_Supplies (5 pins)
PROGRAM_B: FPGA_Bank_0_Supplies (IC4.N12 R82.1), JTAG_Flash_Update (T5.3)
RST_N: Power_Supplies (IC32.23 R187.1 R188.2), CPCIS_Connectors_P1_P6 (R276.2)
SERVMOD_2V5: FPGA_EEM_Misc (IC4.P14 IC17.10 R271.2 R273.2), JTAG_Flash_Update (IC21.5 IC21.13 R105.2)
SERVMOD_3V3: FPGA_EEM_Misc (IC9.21 R129.2 R272.1), JTAG_Flash_Update (IC16.1 IC19.6), CPCIS_Connectors_P1_P6 (R138.1), EEM_Connectors_JTAG (6 pins)
SHARED_BUS_0: FPGA_FMC (IC6.5), CPCIS_Connectors_P1_P6 (R137.1)
SHARED_BUS_1: FPGA_FMC (IC5.5), CPCIS_Connectors_P1_P6 (R139.1)
SHARED_BUS_2: FPGA_FMC (IC6.4), CPCIS_Connectors_P1_P6 (R135.1)
SHARED_BUS_3: FPGA_FMC (IC7.5), CPCIS_Connectors_P1_P6 (R132.1)
SHARED_BUS_4: FPGA_FMC (IC5.4), CPCIS_Connectors_P1_P6 (R134.1)
VADJ_ENABLE: Power_Supplies (IC34.37 R221.2), I2C (IC10.8 IC37.20)

## Assembly variants
EEM: not fitted C1 C2 C9 C11 C16 C29 C30 C44 C46 C47 C48 C49 C50 C51 C94 C95 C96 C154 C155 C165 C166 C167 C201 C202 C213 C214 C217 C218 C286 C305 C? C? D5 D6 D7 D9 IC3 IC5 IC6 IC7 IC13 IC35 IC38 IC39 IC? IC? J6 J7 J11 L29 R1 R2 R3 R4 R10 R14 R22 R36 R38 R39 R40 R41 R73 R74 R75 R77 R94 R114 R115 R127 R128 R129 R130 R131 R132 R133 R134 R135 R136 R137 R138 R139 R140 R141 R142 R143 R144 R145 R146 R147 R148 R149 R150 R151 R152 R153 R154 R155 R156 R157 R158 R159 R161 R162 R163 R164 R167 R168 R169 R170 R171 R172 R173 R174 R175 R176 R177 R197 R199 R245 R246 R251 R253 R263 R271 R274 R275 R276 R277 R279 R280 R281 R282 R283 T15 T17; alternate parts R126 -> R0805_0R_JUMPER
DIOT: not fitted C1 C2 C9 C11 C16 C29 C30 C44 C94 C95 C96 C201 C202 C213 C214 C217 C218 C220 C286 C305 C307 C? C? D8 IC3 IC13 IC26 IC35 IC43 IC? IC? J8 J9 J11 L29 R1 R2 R4 R10 R14 R22 R36 R38 R39 R40 R41 R73 R74 R75 R94 R105 R109 R252 R272 R273